# Altium project main_pcb.PrjPcb
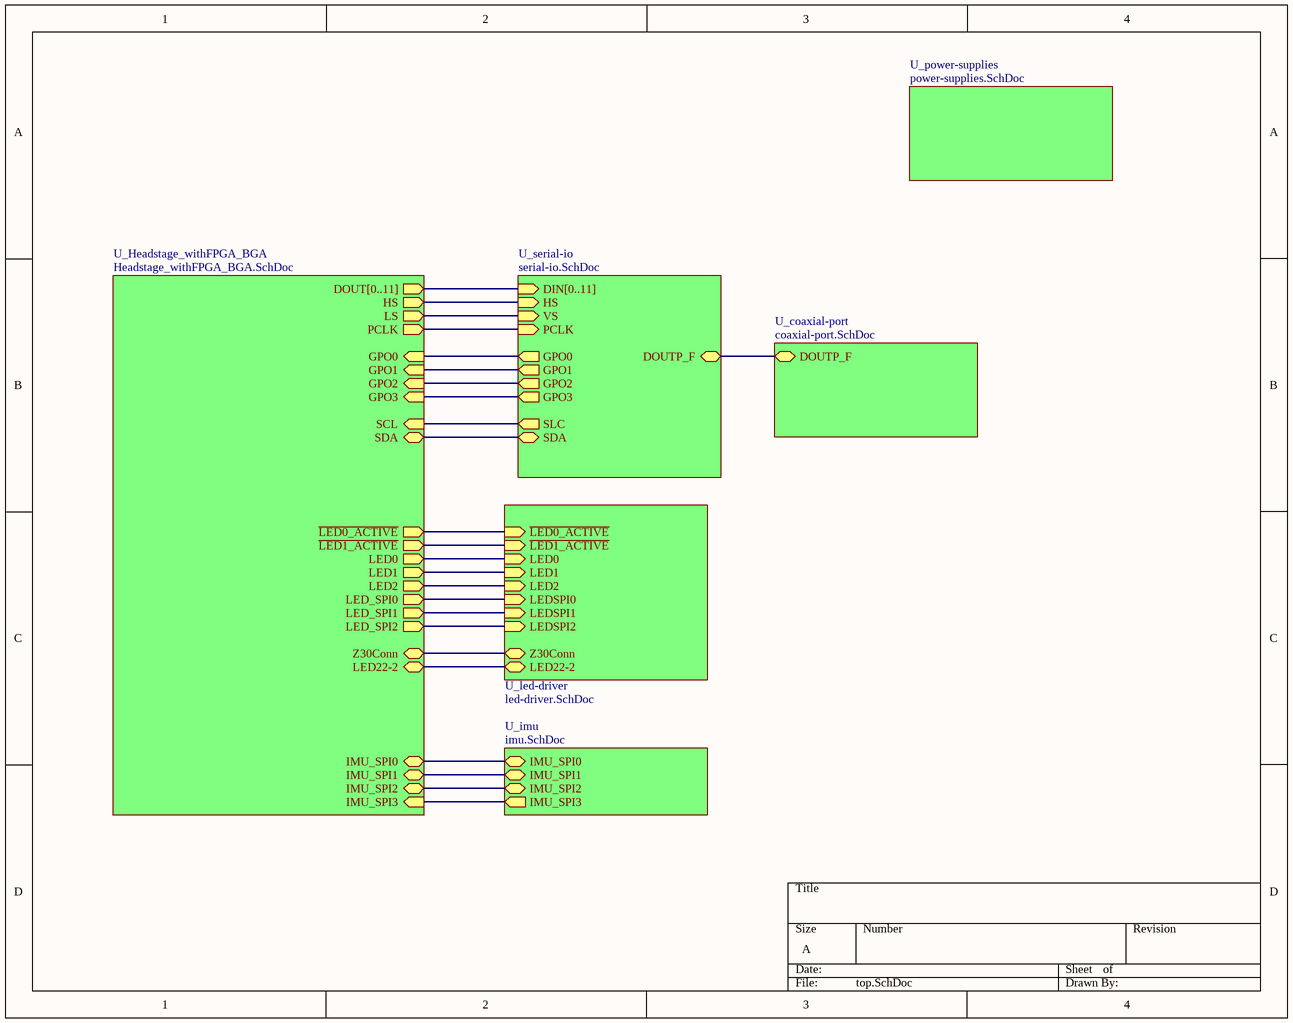
[diagram p0: top.SchDoc]
7 sheets, 127 parts. Net scope: hierarchical (ports join the sheet entries above them; power ports are global).
Board file: top_pcb_4layers_positive.PcbDoc
Sheets:
  top.SchDoc
    U_coaxial-port = coaxial-port.SchDoc
    U_power-supplies = power-supplies.SchDoc
    U_serial-io = serial-io.SchDoc
    U_Headstage_withFPGA_BGA = Headstage_withFPGA_BGA.SchDoc
    U_led-driver = led-driver.SchDoc
    U_imu = imu.SchDoc

## Sheet top.SchDoc
size A

### Sub-sheets
U_coaxial-port = coaxial-port.SchDoc: DOUTP_F (bidir)
U_Headstage_withFPGA_BGA = Headstage_withFPGA_BGA.SchDoc: DOUT[0..11] (out), HS (out), LS (out), PCLK (out), GPO3 (in), GPO2 (in), GPO1 (in), SDA (bidir), SCL (in), GPO0 (in), ~{LED0_ACTIVE} (out), ~{LED1_ACTIVE} (out), LED0 (out), LED1 (out), LED2 (out), LED_SPI0 (out), LED_SPI1 (out), LED_SPI2 (out), Z30Conn (bidir), IMU_SPI0 (bidir), IMU_SPI1 (bidir), IMU_SPI2 (bidir), IMU_SPI3 (in), LED22-2
U_imu = imu.SchDoc: IMU_SPI0 (bidir), IMU_SPI1 (bidir), IMU_SPI2 (bidir), IMU_SPI3 (out)
U_led-driver = led-driver.SchDoc: ~{LED0_ACTIVE} (in), ~{LED1_ACTIVE} (in), LEDSPI0 (in), LED0 (in), LED1 (in), LED2 (in), LEDSPI1 (in), LEDSPI2 (in), Z30Conn (bidir), LED22-2
U_power-supplies = power-supplies.SchDoc: no entries
U_serial-io = serial-io.SchDoc: DIN[0..11] (in), HS (in), VS (in), PCLK (in), DOUTP_F (bidir), SDA (bidir), SLC (out), GPO0 (out), GPO1 (out), GPO2 (out), GPO3 (out)

### Nets
GPO0: sheet U_serial-io/GPO0, sheet U_Headstage_withFPGA_BGA/GPO0
GPO1: sheet U_serial-io/GPO1, sheet U_Headstage_withFPGA_BGA/GPO1
GPO2: sheet U_serial-io/GPO2, sheet U_Headstage_withFPGA_BGA/GPO2
GPO3: sheet U_serial-io/GPO3, sheet U_Headstage_withFPGA_BGA/GPO3
HS: sheet U_serial-io/HS, sheet U_Headstage_withFPGA_BGA/HS
LED0: sheet U_Headstage_withFPGA_BGA/LED0, sheet U_led-driver/LED0
LED1: sheet U_Headstage_withFPGA_BGA/LED1, sheet U_led-driver/LED1
LED2: sheet U_Headstage_withFPGA_BGA/LED2, sheet U_led-driver/LED2
LED22-2: sheet U_Headstage_withFPGA_BGA/LED22-2, sheet U_led-driver/LED22-2
LEDSPI0: sheet U_Headstage_withFPGA_BGA/LED_SPI0, sheet U_led-driver/LEDSPI0
LEDSPI1: sheet U_Headstage_withFPGA_BGA/LED_SPI1, sheet U_led-driver/LEDSPI1
LEDSPI2: sheet U_Headstage_withFPGA_BGA/LED_SPI2, sheet U_led-driver/LEDSPI2
PCLK: sheet U_serial-io/PCLK, sheet U_Headstage_withFPGA_BGA/PCLK
SCL: sheet U_serial-io/SLC, sheet U_Headstage_withFPGA_BGA/SCL
SDA: sheet U_serial-io/SDA, sheet U_Headstage_withFPGA_BGA/SDA
VS: sheet U_serial-io/VS, sheet U_Headstage_withFPGA_BGA/LS
Z30Conn: sheet U_Headstage_withFPGA_BGA/Z30Conn, sheet U_led-driver/Z30Conn
NetC18#1_1: sheet U_coaxial-port/DOUTP_F, sheet U_serial-io/DOUTP_F
NetLD1_21: sheet U_Headstage_withFPGA_BGA/~{LED0_ACTIVE}, sheet U_led-driver/~{LED0_ACTIVE}
NetLD2_21: sheet U_Headstage_withFPGA_BGA/~{LED1_ACTIVE}, sheet U_led-driver/~{LED1_ACTIVE}
(unnamed): sheet U_Headstage_withFPGA_BGA/IMU_SPI0, sheet U_imu/IMU_SPI0
(unnamed): sheet U_Headstage_withFPGA_BGA/IMU_SPI1, sheet U_imu/IMU_SPI1
(unnamed): sheet U_Headstage_withFPGA_BGA/IMU_SPI2, sheet U_imu/IMU_SPI2
(unnamed): sheet U_Headstage_withFPGA_BGA/IMU_SPI3, sheet U_imu/IMU_SPI3

### Buses and harness runs
bus sheet U_Headstage_withFPGA_BGA/DOUT[0..11] = sheet U_serial-io/DIN[0..11]

## Sheet coaxial-port.SchDoc
size A
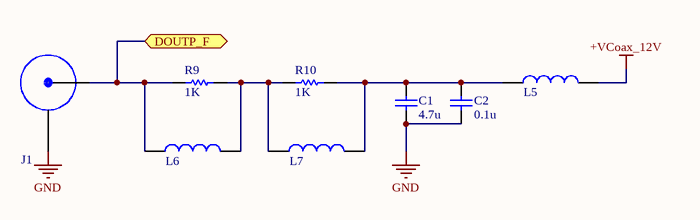
[diagram p1: coaxial-port.SchDoc]

### Parts
C1  value 4.7u  [Cap-0603]  (hidden comment: X7R Ceramic)
C2  value 0.1u  [Cap-0603]  (hidden comment: X7R Ceramic)
J1  Coax Connector  [SMA_132134-10-ND]  (value not drawn)
L5  Ferrite Bead  [BLM18KG601SN1D]  (value not drawn)
L6  Ferrite Bead  [CIG21L4R7MNE]  (value not drawn)
L7  Ferrite Bead  [CBC3225T101MR]  (value not drawn)
R9  value 1K  [Res_0402]  (hidden comment: Res1)
R10  value 1K  [Res_0402]  (hidden comment: Res1)

### Ports
DOUTP_F (bidir)

### Nets
+VCoax_12V: L5.2
GND: C1.1 C2.1 J1.1
NetC1_2: C1.2 C2.2 L5.1 L7.2 R10.1
NetC18#1_1: J1.0 L6.1 R9.2 ; port DOUTP_F
NetL6_2: L6.2 L7.1 R9.1 R10.2

### Library data of the parts
C1 C2 = Cap: Capacitor; Published: 8-Jun-2000; LatestRevisionDate: 17-Jul-2002; LatestRevisionNote: Re-released for DXP Platform.; PackageReference: RAD-0.3; Publisher: Altium Limited; PackageDescription: Radial Cap, Thru-Hole; 2 Leads; 0.3 in Pin Spacing
R9 R10 = Res1: Resistor; Published: 8-Jun-2000; LatestRevisionDate: 17-Jul-2002; LatestRevisionNote: Re-released for DXP Platform.; PackageReference: AXIAL-0.3; Publisher: Altium Limited; PackageDescription: Axial Device, Thru-Hole; 2 Leads; 0.3 in Pin Spacing

## Sheet power-supplies.SchDoc
size A
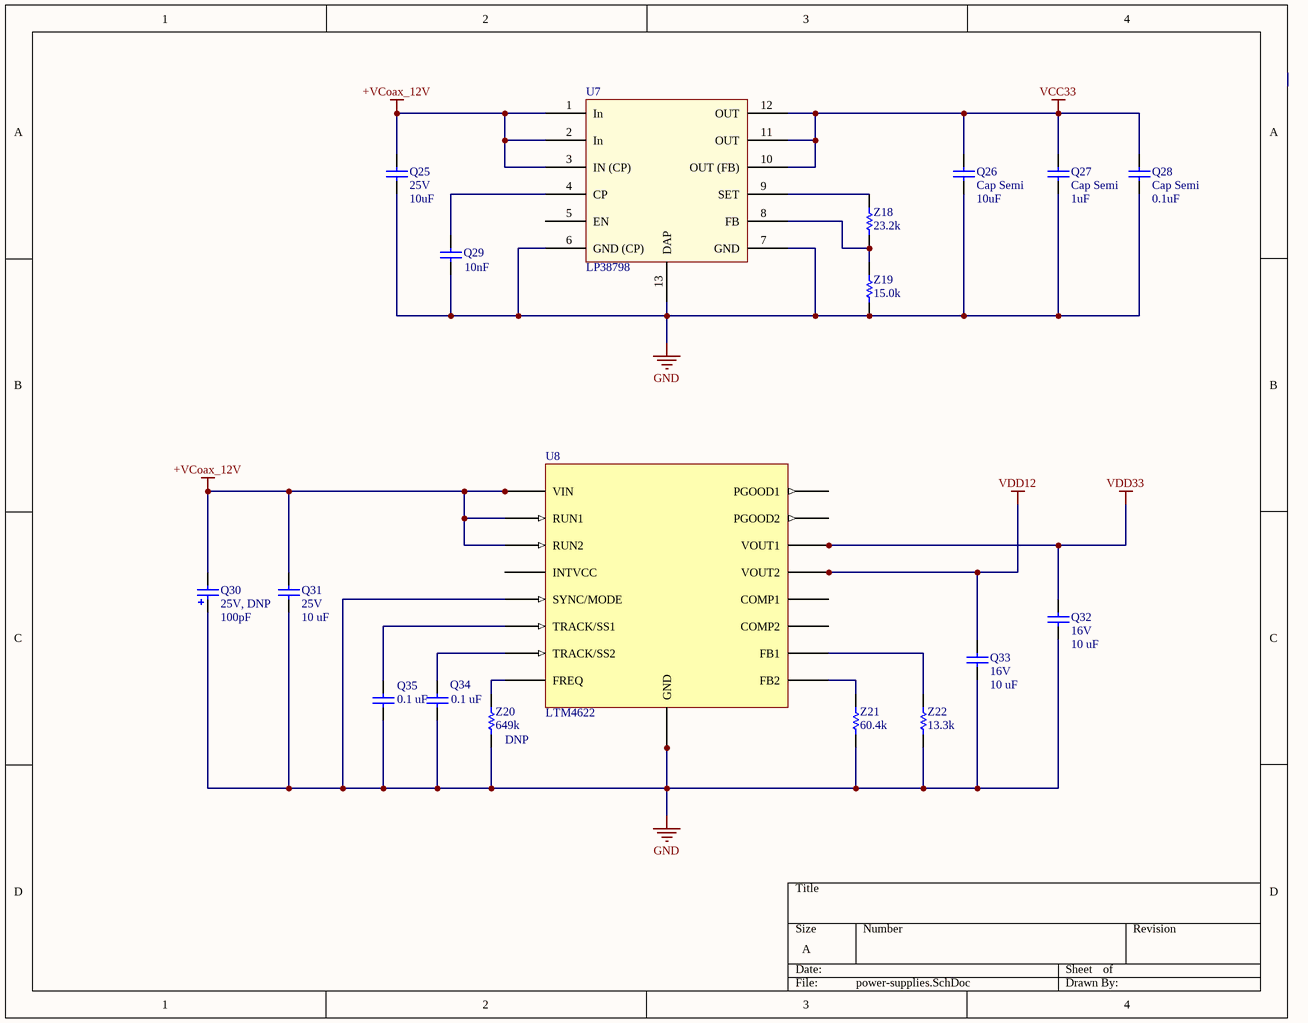
[diagram p2: power-supplies.SchDoc]

### Parts
Q25  25V  value 10uF  [C1206]
Q26  Cap Semi  value 10uF  [Cap-0603]
Q27  Cap Semi  value 1uF  [Cap-0603]
Q28  Cap Semi  value 0.1uF  [Cap-0603]
Q29  value 10nF  [0402]
Q30  25V, DNP  value 100pF  [C0805]
Q31  25V  value 10 uF  [C1206]
Q32  16V  value 10 uF  [C1206]
Q33  16V  value 10 uF  [C1206]
Q34  value 0.1 uF  [C1206]  (hidden comment: 25V)
Q35  value 0.1 uF  [C1206]  (hidden comment: 25V)
U7  LP38798  [DFN12]
U8  LTM4622  [LGA5x5]
Z18  value 23.2k  [Res_0402]  (hidden comment: Res1)
Z19  value 15.0k  [Res_0402]  (hidden comment: Res1)
Z20  DNP  value 649k  [Res_0402]
Z21  value 60.4k  [Res_0402]  (hidden comment: 649k (DNP))
Z22  value 13.3k  [Res_0402]

### Nets
+VCoax_12V: Q25.2 Q30.2 Q31.2 U7.1(In) U7.2(In) U7.3(IN_(CP)) U8.A2(VIN) U8.B2(RUN2) U8.B3(VIN) U8.D2(RUN1) U8.D3(VIN) U8.E2(VIN)
GND: Q25.1 Q26.1 Q27.1 Q28.1 Q29.1 Q30.1 Q31.1 Q32.1 Q33.1 Q34.1 Q35.1 U7.6(GND_(CP)) U7.7(GND) U7.13(DAP) U8.B5(GND) U8.C1(GND) U8.C2(GND) U8.C5(SYNC/MODE) U8.D5(GND) Z19.2 Z20.2 Z21.2 Z22.2
VCC33: Q26.2 Q27.2 Q28.2 U7.10(OUT_(FB)) U7.11(OUT) U7.12(OUT)
VDD12: Q33.2 U8.A1(VOUT2) U8.B1(VOUT2)
VDD33: Q32.2 U8.D1(VOUT1) U8.E1(VOUT1)
NetQ29_2: Q29.2 U7.4(CP)
NetQ34_2: Q34.2 U8.A3(TRACK/SS2)
NetQ35_2: Q35.2 U8.E5(TRACK/SS1)
NetU7_8: U7.8(FB) Z18.2 Z19.1
NetU7_9: U7.9(SET) Z18.1
NetU8_A4: U8.A4(FB2) Z21.1
NetU8_C4: U8.C4(FREQ) Z20.1
NetU8_E4: U8.E4(FB1) Z22.1

Not connected (* = marked no-connect by the designer): U7 5(EN); U8 A5(COMP2) B4(PGOOD2) C3(INTVCC) D4(PGOOD1)

### Library data of the parts
Q25-Q29 Q31-Q35 = Cap Semi: Capacitor (Semiconductor SIM Model); Published: 8-Jun-2000; LatestRevisionDate: 29-May-2009; LatestRevisionNote: IPC-7351 Footprint Added.; PackageReference: C1206; Publisher: Altium Limited; PackageDescription: Chip Capacitor
  Q31 Q34 Q35: Voltage: 25 V
  Q32 Q33: Voltage: 16 V
Q30 = Cap Pol3: Polarized Capacitor (Surface Mount); Published: 8-Jun-2000; LatestRevisionDate: 29-May-2009; LatestRevisionNote: IPC-7351 Footprint Added.; PackageReference: C0805; Publisher: Altium Limited; PackageDescription: Chip Capacitor
U7 = Component_1: Low Noise Positive LDO
Z18-Z22 = Res1: Resistor; Published: 8-Jun-2000; LatestRevisionDate: 17-Jul-2002; LatestRevisionNote: Re-released for DXP Platform.; PackageReference: AXIAL-0.3; Publisher: Altium Limited; PackageDescription: Axial Device, Thru-Hole; 2 Leads; 0.3 in Pin Spacing

## Sheet serial-io.SchDoc
size A
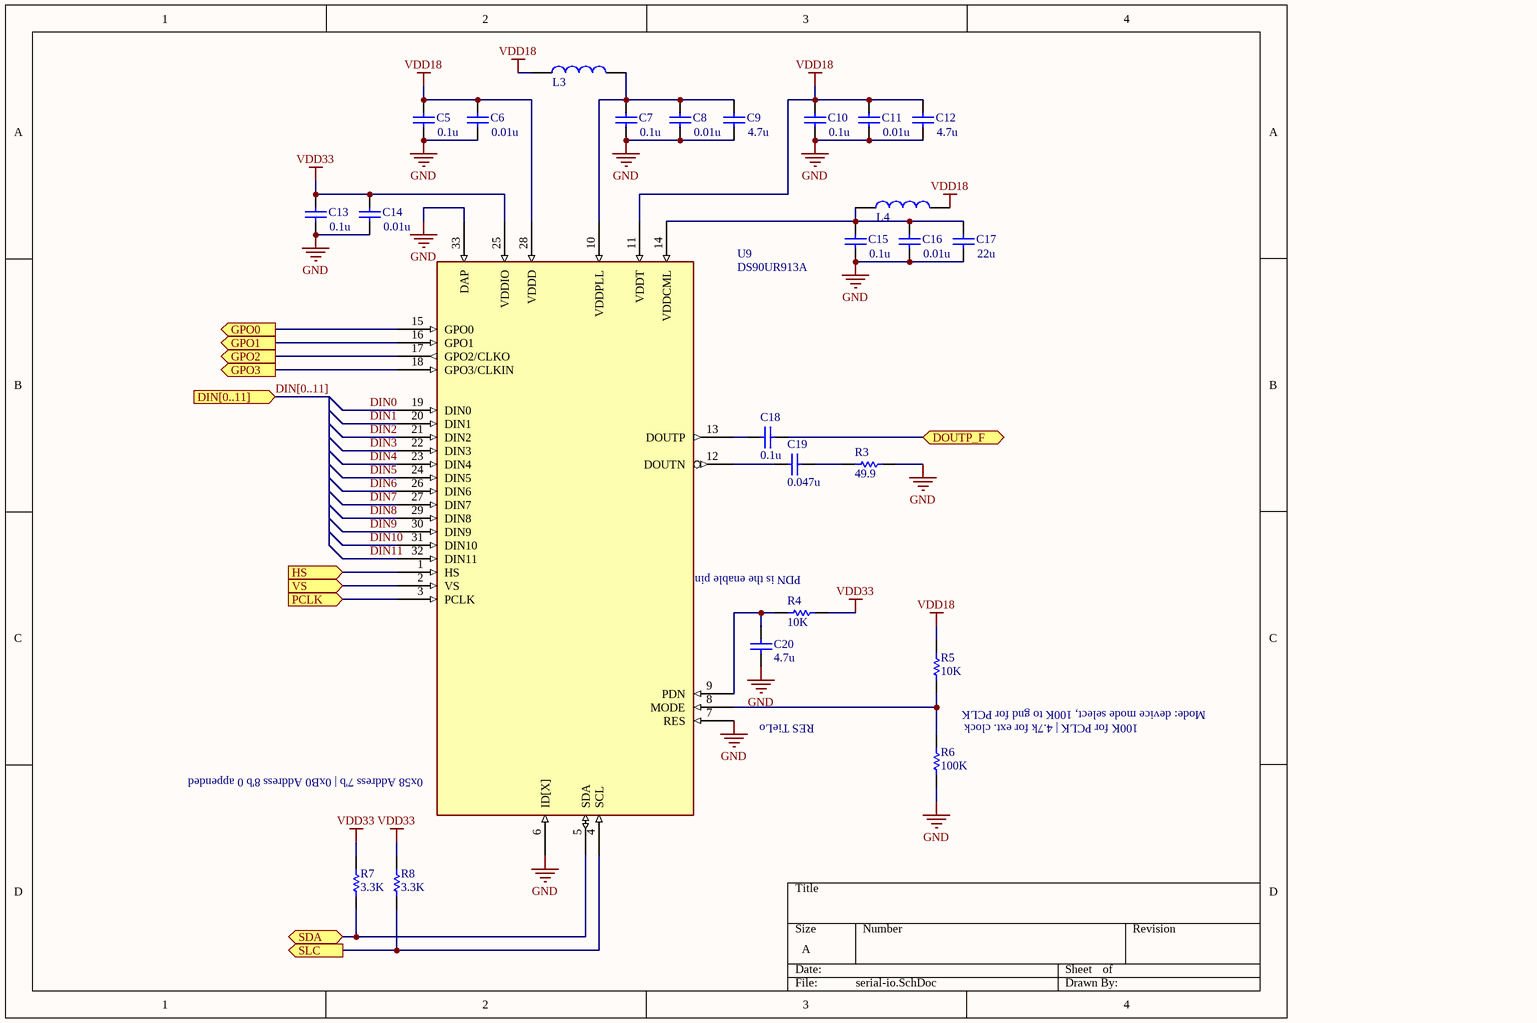
[diagram p3: serial-io.SchDoc]

### Parts
(Parts that share a designator on the sheet are numbered #1, #2 ... from top to bottom, then left to right.)
C5  value 0.1u  [Cap_0402]  (hidden comment: X7R Ceramic)
C6  value 0.01u  [Cap_0402]  (hidden comment: X7R Ceramic)
C7  value 0.1u  [Cap_0402]  (hidden comment: X7R Ceramic)
C8  value 0.01u  [Cap_0402]  (hidden comment: X7R Ceramic)
C9  value 4.7u  [Cap_0402]  (hidden comment: X7R Ceramic)
C10  value 0.1u  [Cap_0402]  (hidden comment: X7R Ceramic)
C11  value 0.01u  [Cap_0402]  (hidden comment: X7R Ceramic)
C12  value 4.7u  [Cap_0402]  (hidden comment: X7R Ceramic)
C13  value 0.1u  [Cap_0402]  (hidden comment: X7R Ceramic)
C14  value 0.01u  [Cap_0402]  (hidden comment: X7R Ceramic)
C15  value 0.1u  [Cap_0402]  (hidden comment: X7R Ceramic)
C16  value 0.01u  [Cap_0402]  (hidden comment: X7R Ceramic)
C17  value 22u  [Cap-0603]  (hidden comment: X7R Ceramic)
C18#1  value 0.1u  [Cap_0402]  (hidden comment: X7R Ceramic)
C19  value 0.047u  [Cap_0402]  (hidden comment: X7R Ceramic)
C20  value 4.7u  [Cap_0402]  (hidden comment: X7R Ceramic)
L3  Ferrite Bead  [BLM18KG601SN1D]  (value not drawn)
L4  Ferrite Bead  [BLM18KG601SN1D]  (value not drawn)
R3  value 49.9  [Res_0402]  (hidden comment: Res1)
R4  value 10K  [Res_0402]  (hidden comment: Res1)
R5  value 10K  [Res_0402]  (hidden comment: Res1)
R6  value 100K  [Res_0402]  (hidden comment: Res1)
R7  value 3.3K  [Res_0402]  (hidden comment: Res1)
R8  value 3.3K  [Res_0402]  (hidden comment: Res1)
U9  DS90UR913A  [WQFN32-DS90UB913A]

### Ports
DIN[0..11] (in), DOUTP_F (bidir), GPO0 (out), GPO1 (out), GPO2 (out), GPO3 (out), HS (in), PCLK (in), SDA (bidir), SLC (out), VS (in)

### Nets
GND: C5.1 C6.1 C7.1 C8.1 C9.1 C10.1 C11.1 C12.1 C13.1 C14.1 C15.1 C16.1 C17.1 C20.1 R3.2 R6.1 U9.6(ID[X]) U9.7(RES) U9.33(DAP)
VDD18: C5.2 C6.2 C10.2 C11.2 C12.2 L3.1 L4.2 R5.2 U9.11(VDDT) U9.28(VDDD)
VDD33: C13.2 C14.2 R4.2 R7.2 R8.2 U9.25(VDDIO)
DIN0: U9.19(DIN0)
DIN1: U9.20(DIN1)
DIN2: U9.21(DIN2)
DIN3: U9.22(DIN3)
DIN4: U9.23(DIN4)
DIN5: U9.24(DIN5)
DIN6: U9.26(DIN6)
DIN7: U9.27(DIN7)
DIN8: U9.29(DIN8)
DIN9: U9.30(DIN9)
DIN10: U9.31(DIN10)
DIN11: U9.32(DIN11)
GPO0: U9.15(GPO0) ; port GPO0
GPO1: U9.16(GPO1) ; port GPO1
GPO2: U9.17(GPO2/CLKO) ; port GPO2
GPO3: U9.18(GPO3/CLKIN) ; port GPO3
HS: U9.1(HS) ; port HS
PCLK: U9.3(PCLK) ; port PCLK
SCL: R8.1 U9.4(SCL) ; port SLC
SDA: R7.1 U9.5(SDA) ; port SDA
VS: U9.2(VS) ; port VS
NetC7_2: C7.2 C8.2 C9.2 L3.2 U9.10(VDDPLL)
NetC15_2: C15.2 C16.2 C17.2 L4.1 U9.14(VDDCML)
NetC18#1_1: C18#1.1 ; port DOUTP_F
NetC18#1_2: C18#1.2 U9.13(DOUTP)
NetC19_1: C19.1 R3.1
NetC19_2: C19.2 U9.12(DOUTN)
NetC20_2: C20.2 R4.1 U9.9(PDN)
NetR5_1: R5.1 R6.2 U9.8(MODE)

### Buses and harness runs
bus DIN[0..11] = port DIN[0..11]

### Notes on the sheet
- (near U9) PDN is the enable pin
- Mode: device mode select, 100K to gnd for PCLK
- (near U9) 0x58 Address 7'b | 0xB0 Address 8'b 0 appended
- RES TieLo
- (near R6) 100K for PCLK | 4.7k for ext. clock

### Library data of the parts
C5-C17 C18#1 C19 C20 = Cap: Capacitor; Published: 8-Jun-2000; LatestRevisionDate: 17-Jul-2002; LatestRevisionNote: Re-released for DXP Platform.; PackageReference: RAD-0.3; Publisher: Altium Limited; PackageDescription: Radial Cap, Thru-Hole; 2 Leads; 0.3 in Pin Spacing
R3-R8 = Res1: Resistor; Published: 8-Jun-2000; LatestRevisionDate: 17-Jul-2002; LatestRevisionNote: Re-released for DXP Platform.; PackageReference: AXIAL-0.3; Publisher: Altium Limited; PackageDescription: Axial Device, Thru-Hole; 2 Leads; 0.3 in Pin Spacing
U9 = DS90UR913A: DS90UR913ASERIALIZER

## Sheet Headstage_withFPGA_BGA.SchDoc
size D
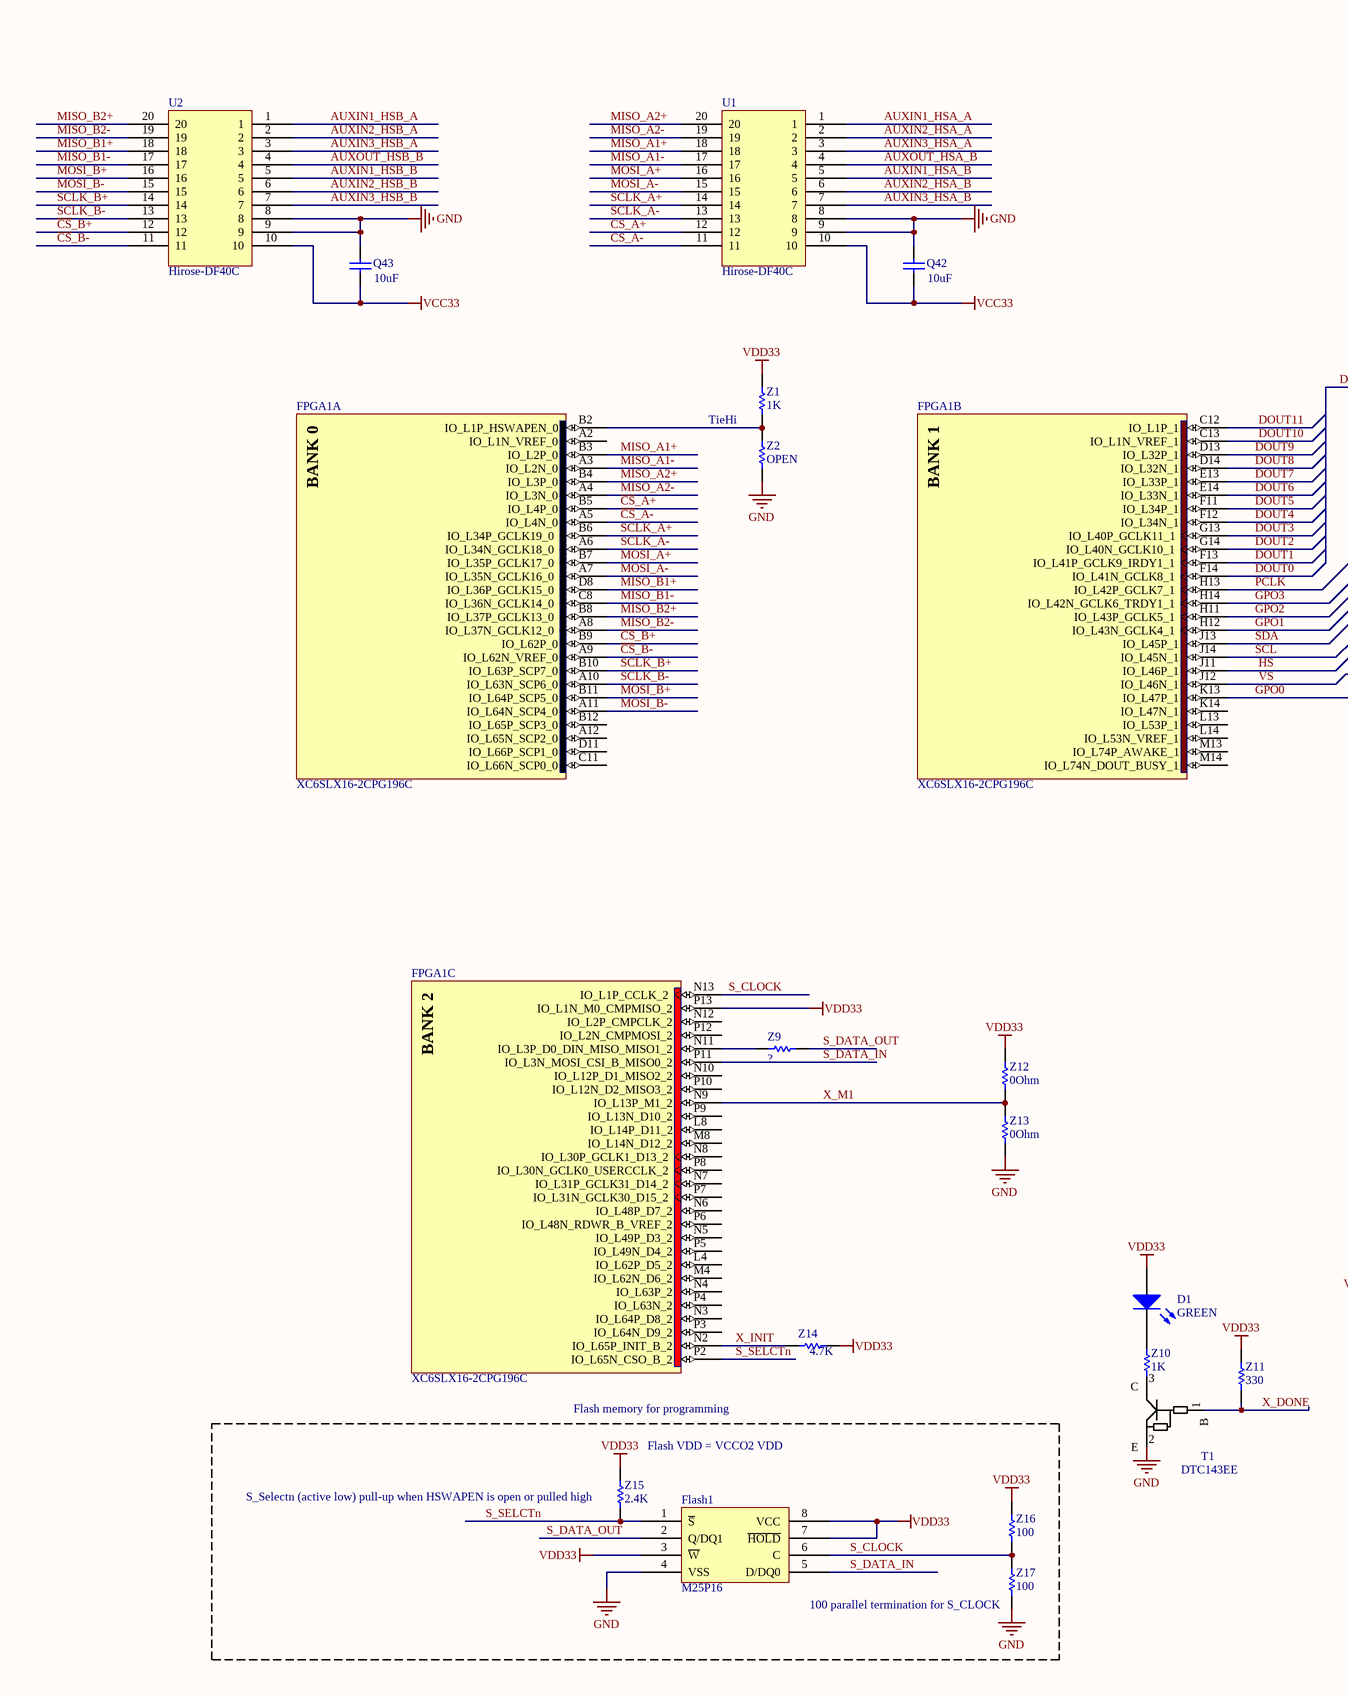
[diagram p4: Headstage_withFPGA_BGA.SchDoc, left]
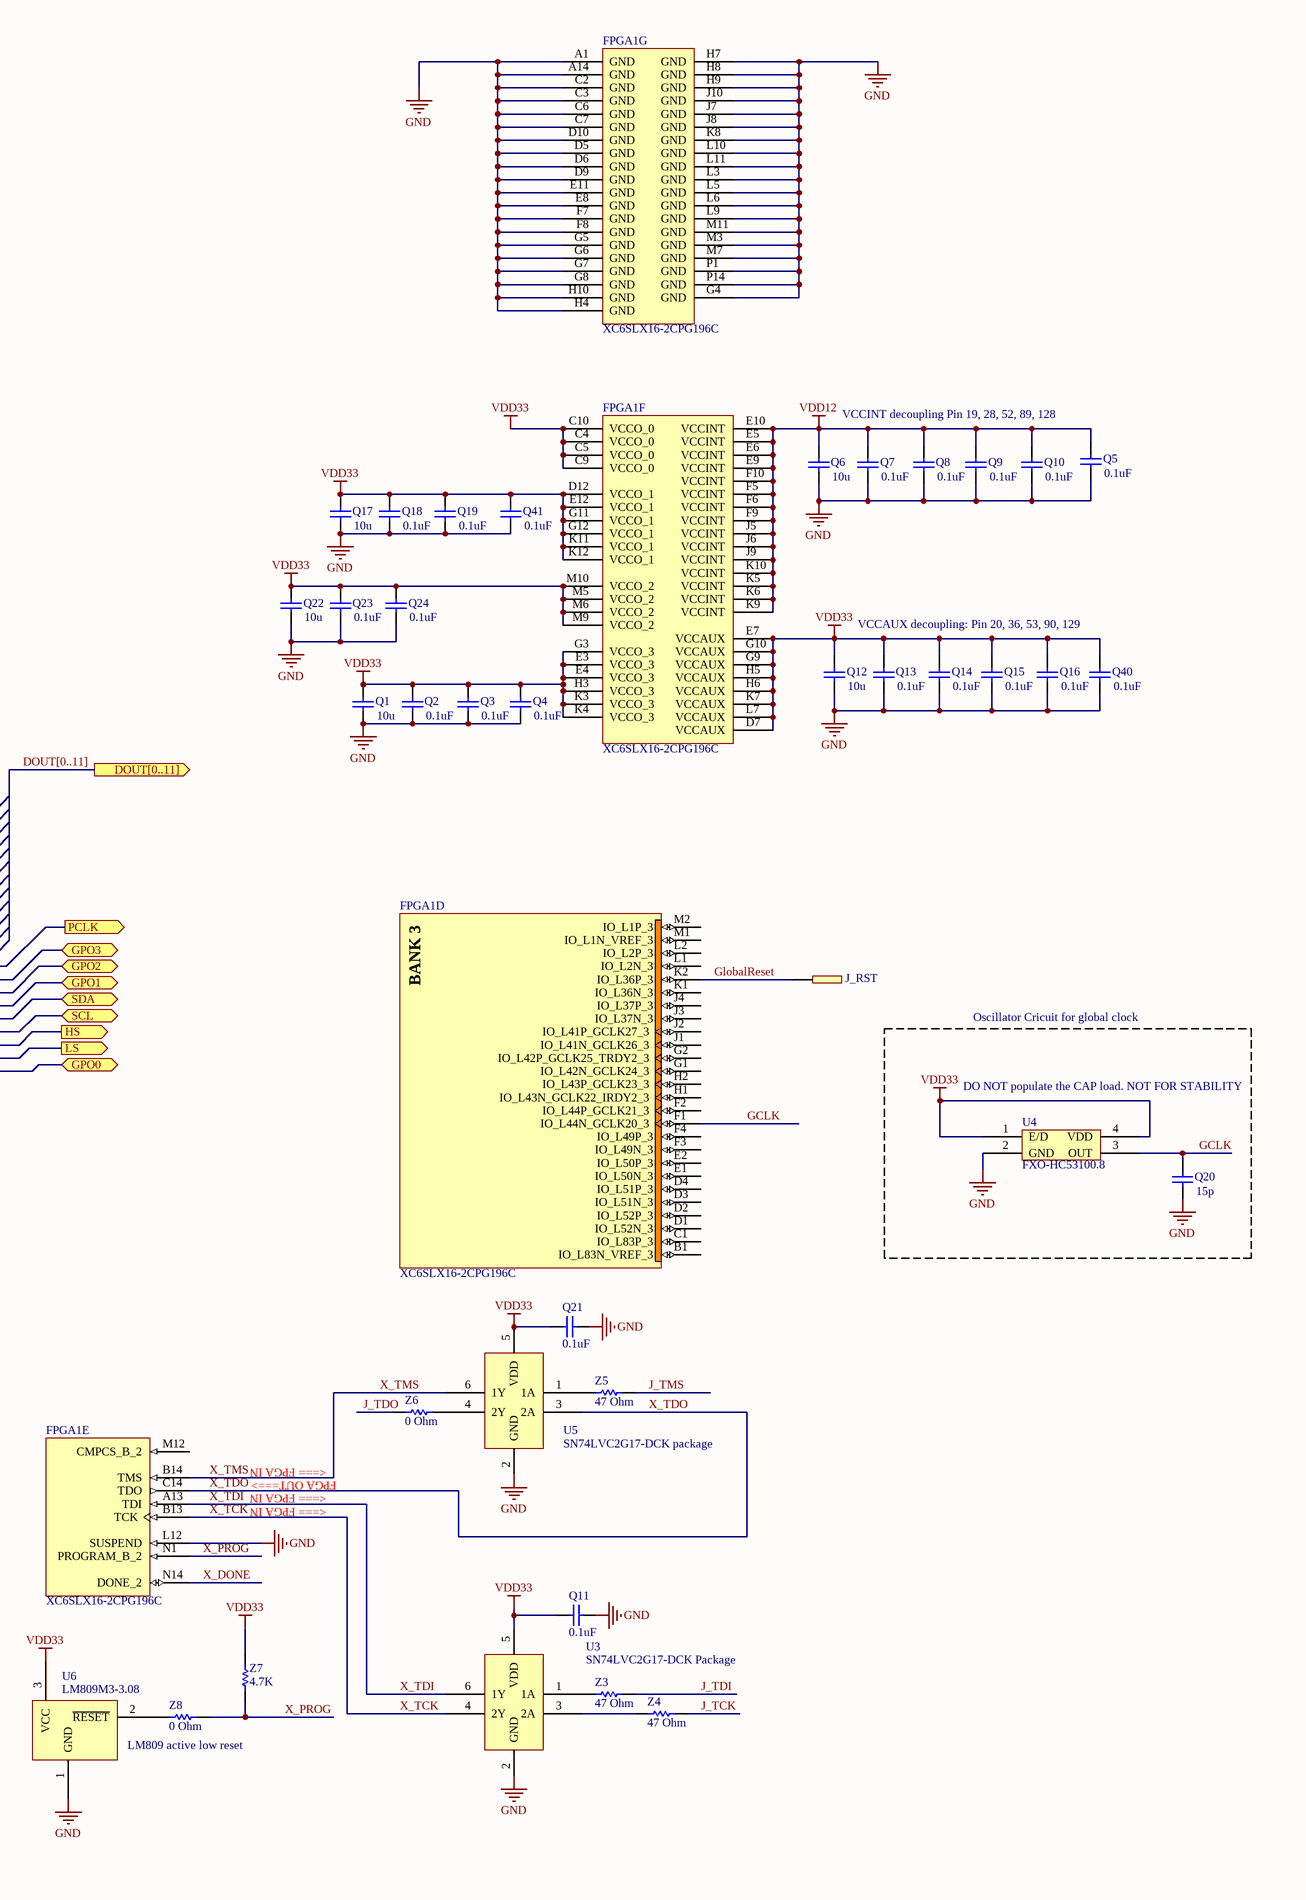
[diagram p5: Headstage_withFPGA_BGA.SchDoc, right]

### Parts
(Parts that share a designator on the sheet are numbered #1, #2 ... from top to bottom, then left to right.)
D1  GREEN  [RES_0603]
Flash1  M25P16  [M25P16-S08N]
FPGA1  XC6SLX16-2CPG196C  [CPG196]  (parts A,B,C,D,E,F,G of 7)
J_RST  Header_1PIN  [JUMPER1PIN]  (value not drawn)
Q1  value 10u  [Cap-0603]  (hidden comment: X7R Ceramic)
Q2  value 0.1uF  [Cap_0402]  (hidden comment: X7R Ceramic)
Q3  value 0.1uF  [Cap_0402]  (hidden comment: X7R Ceramic)
Q4  value 0.1uF  [Cap_0402]  (hidden comment: X7R Ceramic)
Q5  value 0.1uF  [Cap_0402]  (hidden comment: X7R Ceramic)
Q6  value 10u  [Cap-0603]  (hidden comment: X7R Ceramic)
Q7  value 0.1uF  [Cap_0402]  (hidden comment: X7R Ceramic)
Q8  value 0.1uF  [Cap_0402]  (hidden comment: X7R Ceramic)
Q9  value 0.1uF  [Cap_0402]  (hidden comment: X7R Ceramic)
Q10  value 0.1uF  [Cap_0402]  (hidden comment: X7R Ceramic)
Q11  value 0.1uF  [Cap-0603]  (hidden comment: X7R Ceramic)
Q12  value 10u  [Cap-0603]  (hidden comment: X7R Ceramic)
Q13  value 0.1uF  [Cap_0402]  (hidden comment: X7R Ceramic)
Q14  value 0.1uF  [Cap_0402]  (hidden comment: X7R Ceramic)
Q15  value 0.1uF  [Cap_0402]  (hidden comment: X7R Ceramic)
Q16  value 0.1uF  [Cap_0402]  (hidden comment: X7R Ceramic)
Q17  value 10u  [Cap-0603]  (hidden comment: X7R Ceramic)
Q18  value 0.1uF  [Cap_0402]  (hidden comment: X7R Ceramic)
Q19  value 0.1uF  [Cap_0402]  (hidden comment: X7R Ceramic)
Q20  value 15p  [Cap-0603]  (hidden comment: X7R Ceramic)
Q21  value 0.1uF  [Cap-0603]  (hidden comment: X7R Ceramic)
Q22  value 10u  [Cap-0603]  (hidden comment: X7R Ceramic)
Q23  value 0.1uF  [Cap_0402]  (hidden comment: X7R Ceramic)
Q24  value 0.1uF  [Cap_0402]  (hidden comment: X7R Ceramic)
Q40  value 0.1uF  [Cap_0402]  (hidden comment: X7R Ceramic)
Q41  value 0.1uF  [Cap_0402]  (hidden comment: X7R Ceramic)
Q42  value 10uF  [Cap_0402]  (hidden comment: X7R Ceramic)
Q43  value 10uF  [Cap_0402]  (hidden comment: X7R Ceramic)
T1  DTC143EE  [VMT3]
U1#1  Hirose-DF40C  [DF40]
U2  Hirose-DF40C  [DF40]
U3  SN74LVC2G17-DCK Package  [SN74LVC2G17-DCK-package]
U4  FXO-HC53100.8  [FXO-HC53]
U5  SN74LVC2G17-DCK package  [SN74LVC2G17-DCK-package]
U6  LM809M3-3.08  [SOT23]
Z1  value 1K  [Res_0402]  (hidden comment: Res1)
Z2  value OPEN  [Res_0402]  (hidden comment: Res1)
Z3  value 47 Ohm  [Res_0402]  (hidden comment: Res1)
Z4  value 47 Ohm  [Res_0402]  (hidden comment: Res1)
Z5  value 47 Ohm  [Res_0402]  (hidden comment: Res1)
Z6  value 0 Ohm  [Res_0402]  (hidden comment: Res1)
Z7  value 4.7K  [Res_0402]  (hidden comment: Res1)
Z8  value 0 Ohm  [Res_0402]  (hidden comment: Res1)
Z9  Res1  [Res_0402]  (value not drawn)
Z10  value 1K  [Res_0402]  (hidden comment: Res1)
Z11  value 330  [Res_0402]  (hidden comment: Res1)
Z12  value 0Ohm  [Res_0402]  (hidden comment: Res1)
Z13  value 0Ohm  [Res_0402]  (hidden comment: Res1)
Z14  value 4.7K  [Res_0402]  (hidden comment: Res1)
Z15  value 2.4K  [Res_0402]  (hidden comment: Res1)
Z16  value 100  [Res_0402]  (hidden comment: Res1)
Z17  value 100  [Res_0402]  (hidden comment: Res1)

### Ports
DOUT[0..11] (out), GPO0 (bidir), GPO1 (bidir), GPO2 (bidir), GPO3 (bidir), HS (out), LS (out), PCLK (out), SCL (bidir), SDA (bidir)

### Nets
GND: Flash1.4(VSS) FPGA1.A1(GND) FPGA1.A14(GND) FPGA1.C2(GND) FPGA1.C3(GND) FPGA1.C6(GND) FPGA1.C7(GND) FPGA1.D5(GND) FPGA1.D6(GND) FPGA1.D9(GND) FPGA1.D10(GND) FPGA1.E8(GND) FPGA1.E11(GND) FPGA1.F7(GND) FPGA1.F8(GND) FPGA1.G4(GND) FPGA1.G5(GND) FPGA1.G6(GND) FPGA1.G7(GND) FPGA1.G8(GND) FPGA1.H4(GND) FPGA1.H7(GND) FPGA1.H8(GND) FPGA1.H9(GND) FPGA1.H10(GND) FPGA1.J7(GND) FPGA1.J8(GND) FPGA1.J10(GND) FPGA1.K8(GND) FPGA1.L3(GND) FPGA1.L5(GND) FPGA1.L6(GND) FPGA1.L9(GND) FPGA1.L10(GND) FPGA1.L11(GND) FPGA1.L12(SUSPEND) FPGA1.M3(GND) FPGA1.M7(GND) FPGA1.M11(GND) FPGA1.P1(GND) FPGA1.P14(GND) Q1.1 Q2.1 Q3.1 Q4.1 Q5.1 Q6.1 Q7.1 Q8.1 Q9.1 Q10.1 Q11.1 Q12.1 Q13.1 Q14.1 Q15.1 Q16.1 Q17.1 Q18.1 Q19.1 Q20.1 Q21.1 Q22.1 Q23.1 Q24.1 Q40.1 Q41.1 Q42.2 Q43.2 T1.2(E) U1#1.8 U1#1.9 U2.8 U2.9 U3.2(GND) U4.2(GND) U5.2(GND) U6.1(GND) Z2.1 Z13.1 Z17.1
VCC33: Q42.1 Q43.1 U1#1.10 U2.10
VDD12: FPGA1.E5(VCCINT) FPGA1.E6(VCCINT) FPGA1.E9(VCCINT) FPGA1.E10(VCCINT) FPGA1.F5(VCCINT) FPGA1.F6(VCCINT) FPGA1.F9(VCCINT) FPGA1.F10(VCCINT) FPGA1.J5(VCCINT) FPGA1.J6(VCCINT) FPGA1.J9(VCCINT) FPGA1.K5(VCCINT) FPGA1.K6(VCCINT) FPGA1.K9(VCCINT) FPGA1.K10(VCCINT) Q5.2 Q6.2 Q7.2 Q8.2 Q9.2 Q10.2
VDD33: D1.1(A) Flash1.3(~{W}) Flash1.7(~{HOLD}) Flash1.8(VCC) FPGA1.C4(VCCO_0) FPGA1.C5(VCCO_0) FPGA1.C9(VCCO_0) FPGA1.C10(VCCO_0) FPGA1.D7(VCCAUX) FPGA1.D12(VCCO_1) FPGA1.E3(VCCO_3) FPGA1.E4(VCCO_3) FPGA1.E7(VCCAUX) FPGA1.E12(VCCO_1) FPGA1.G3(VCCO_3) FPGA1.G9(VCCAUX) FPGA1.G10(VCCAUX) FPGA1.G11(VCCO_1) FPGA1.G12(VCCO_1) FPGA1.H3(VCCO_3) FPGA1.H5(VCCAUX) FPGA1.H6(VCCAUX) FPGA1.K3(VCCO_3) FPGA1.K4(VCCO_3) FPGA1.K7(VCCAUX) FPGA1.K11(VCCO_1) FPGA1.K12(VCCO_1) FPGA1.L7(VCCAUX) FPGA1.M5(VCCO_2) FPGA1.M6(VCCO_2) FPGA1.M9(VCCO_2) FPGA1.M10(VCCO_2) FPGA1.P13(IO_L1N_M0_CMPMISO_2) Q1.2 Q2.2 Q3.2 Q4.2 Q11.2 Q12.2 Q13.2 Q14.2 Q15.2 Q16.2 Q17.2 Q18.2 Q19.2 Q21.2 Q22.2 Q23.2 Q24.2 Q40.2 Q41.2 U3.5(VDD) U4.1(E/D) U4.4(VDD) U5.5(VDD) U6.3(VCC) Z1.2 Z7.1 Z11.2 Z12.2 Z14.1 Z15.2 Z16.2
AUXIN1_HSA_A: U1#1.1
AUXIN1_HSA_B: U1#1.5
AUXIN1_HSB_A: U2.1
AUXIN1_HSB_B: U2.5
AUXIN2_HSA_A: U1#1.2
AUXIN2_HSA_B: U1#1.6
AUXIN2_HSB_A: U2.2
AUXIN2_HSB_B: U2.6
AUXIN3_HSA_A: U1#1.3
AUXIN3_HSA_B: U1#1.7
AUXIN3_HSB_A: U2.3
AUXIN3_HSB_B: U2.7
AUXOUT_HSA_B: U1#1.4
AUXOUT_HSB_B: U2.4
~{CS}_A+: FPGA1.B5(IO_L4P_0) U1#1.12
~{CS}_A-: FPGA1.A5(IO_L4N_0) U1#1.11
~{CS}_B+: FPGA1.B9(IO_L62P_0) U2.12
~{CS}_B-: FPGA1.A9(IO_L62N_VREF_0) U2.11
DOUT0: FPGA1.F14(IO_L41N_GCLK8_1)  [project net DIN0]
DOUT1: FPGA1.F13(IO_L41P_GCLK9_IRDY1_1)  [project net DIN1]
DOUT2: FPGA1.G14(IO_L40N_GCLK10_1)  [project net DIN2]
DOUT3: FPGA1.G13(IO_L40P_GCLK11_1)  [project net DIN3]
DOUT4: FPGA1.F12(IO_L34N_1)  [project net DIN4]
DOUT5: FPGA1.F11(IO_L34P_1)  [project net DIN5]
DOUT6: FPGA1.E14(IO_L33N_1)  [project net DIN6]
DOUT7: FPGA1.E13(IO_L33P_1)  [project net DIN7]
DOUT8: FPGA1.D14(IO_L32N_1)  [project net DIN8]
DOUT9: FPGA1.D13(IO_L32P_1)  [project net DIN9]
DOUT10: FPGA1.C13(IO_L1N_VREF_1)  [project net DIN10]
DOUT11: FPGA1.C12(IO_L1P_1)  [project net DIN11]
GCLK: FPGA1.F1(IO_L44N_GCLK20_3) Q20.2 U4.3(OUT)
GlobalReset: FPGA1.K2(IO_L36P_3) J_RST.0
GPO0: FPGA1.K13(IO_L47P_1) ; port GPO0
GPO1: FPGA1.H12(IO_L43N_GCLK4_1) ; port GPO1
GPO2: FPGA1.H11(IO_L43P_GCLK5_1) ; port GPO2
GPO3: FPGA1.H14(IO_L42N_GCLK6_TRDY1_1) ; port GPO3
HS: FPGA1.J11(IO_L46P_1) ; port HS
J_TCK: Z4.1
J_TDI: Z3.1
J_TDO: Z6.2
J_TMS: Z5.1
MISO_A1+: FPGA1.B3(IO_L2P_0) U1#1.18
MISO_A1-: FPGA1.A3(IO_L2N_0) U1#1.17
MISO_A2+: FPGA1.B4(IO_L3P_0) U1#1.20
MISO_A2-: FPGA1.A4(IO_L3N_0) U1#1.19
MISO_B1+: FPGA1.D8(IO_L36P_GCLK15_0) U2.18
MISO_B1-: FPGA1.C8(IO_L36N_GCLK14_0) U2.17
MISO_B2+: FPGA1.B8(IO_L37P_GCLK13_0) U2.20
MISO_B2-: FPGA1.A8(IO_L37N_GCLK12_0) U2.19
MOSI_A+: FPGA1.B7(IO_L35P_GCLK17_0) U1#1.16
MOSI_A-: FPGA1.A7(IO_L35N_GCLK16_0) U1#1.15
MOSI_B+: FPGA1.B11(IO_L64P_SCP5_0) U2.16
MOSI_B-: FPGA1.A11(IO_L64N_SCP4_0) U2.15
PCLK: FPGA1.H13(IO_L42P_GCLK7_1) ; port PCLK
S_CLOCK: Flash1.6(C) FPGA1.N13(IO_L1P_CCLK_2) Z16.1 Z17.2
S_DATA_IN: Flash1.5(D/DQ0) FPGA1.P11(IO_L3N_MOSI_CSI_B_MISO0_2)
S_DATA_OUT: Flash1.2(Q/DQ1) Z9.1
S_SELCTn: Flash1.1(~{S}) FPGA1.P2(IO_L65N_CSO_B_2) Z15.1
SCL: FPGA1.J14(IO_L45N_1) ; port SCL
SCLK_A+: FPGA1.B6(IO_L34P_GCLK19_0) U1#1.14
SCLK_A-: FPGA1.A6(IO_L34N_GCLK18_0) U1#1.13
SCLK_B+: FPGA1.B10(IO_L63P_SCP7_0) U2.14
SCLK_B-: FPGA1.A10(IO_L63N_SCP6_0) U2.13
SDA: FPGA1.J13(IO_L45P_1) ; port SDA
VS: FPGA1.J12(IO_L46N_1) ; port LS
X_DONE: FPGA1.N14(DONE_2) T1.1(B) Z11.1
X_INIT: FPGA1.N2(IO_L65P_INIT_B_2) Z14.2
X_M1: FPGA1.N9(IO_L13P_M1_2) Z12.1 Z13.2
X_PROG: FPGA1.N1(PROGRAM_B_2) Z7.2 Z8.1
X_TCK: FPGA1.B13(TCK) U3.4(2Y)
X_TDI: FPGA1.A13(TDI) U3.6(1Y)
X_TDO: FPGA1.C14(TDO) U5.3(2A)
X_TMS: FPGA1.B14(TMS) U5.6(1Y)
NetD1_2: D1.2(K) Z10.2
NetFPGA1_B2: FPGA1.B2(IO_L1P_HSWAPEN_0) Z1.1 Z2.2
NetFPGA1_N11: FPGA1.N11(IO_L3P_D0_DIN_MISO_MISO1_2) Z9.2
NetU3_1: U3.1(1A) Z3.2
NetU3_3: U3.3(2A) Z4.2
NetU5_1: U5.1(1A) Z5.2
NetU5_4: U5.4(2Y) Z6.1
NetU6_2: U6.2(~{RESET}) Z8.2

Not connected (* = marked no-connect by the designer): FPGA1 A2(IO_L1N_VREF_0) A12(IO_L65N_SCP2_0) B1(IO_L83N_VREF_3) B12(IO_L65P_SCP3_0) C1(IO_L83P_3) C11(IO_L66N_SCP0_0) D1(IO_L52N_3) D2(IO_L52P_3) D3(IO_L51N_3) D4(IO_L51P_3) D11(IO_L66P_SCP1_0) E1(IO_L50N_3) E2(IO_L50P_3) F2(IO_L44P_GCLK21_3) F3(IO_L49N_3) F4(IO_L49P_3) G1(IO_L42N_GCLK24_3) G2(IO_L42P_GCLK25_TRDY2_3) H1(IO_L43N_GCLK22_IRDY2_3) H2(IO_L43P_GCLK23_3) J1(IO_L41N_GCLK26_3) J2(IO_L41P_GCLK27_3) J3(IO_L37N_3) J4(IO_L37P_3) K1(IO_L36N_3) K14(IO_L47N_1) L1(IO_L2N_3) L2(IO_L2P_3) L4(IO_L62P_D5_2) L8(IO_L14P_D11_2) L13(IO_L53P_1) L14(IO_L53N_VREF_1) M1(IO_L1N_VREF_3) M2(IO_L1P_3) M4(IO_L62N_D6_2) M8(IO_L14N_D12_2) M12(CMPCS_B_2) M13(IO_L74P_AWAKE_1) M14(IO_L74N_DOUT_BUSY_1) N3(IO_L64P_D8_2) N4(IO_L63P_2) N5(IO_L49P_D3_2) N6(IO_L48P_D7_2) N7(IO_L31P_GCLK31_D14_2) N8(IO_L30P_GCLK1_D13_2) N10(IO_L12P_D1_MISO2_2) N12(IO_L2P_CMPCLK_2) P3(IO_L64N_D9_2) P4(IO_L63N_2) P5(IO_L49N_D4_2) P6(IO_L48N_RDWR_B_VREF_2) P7(IO_L31N_GCLK30_D15_2) P8(IO_L30N_GCLK0_USERCCLK_2) P9(IO_L13N_D10_2) P10(IO_L12N_D2_MISO3_2) P12(IO_L2N_CMPMOSI_2); T1 3(C); Z10 1

### Buses and harness runs
bus DOUT[0..11] = port DOUT[0..11]

### Notes on the sheet
- VCCINT decoupling Pin 19, 28, 52, 89, 128
- VCCAUX decoupling: Pin 20, 36, 53, 90, 129
- TieHi
- Oscillator Cricuit for global clock
- (near U4) DO NOT populate the CAP load. NOT FOR STABILITY
- <=== FPGA IN
- FPGA OUT===>
- Flash memory for programming
- (near U6) LM809 active low reset
- (near Z15) Flash VDD = VCCO2 VDD
- (near Z15) S_Selectn (active low) pull-up when HSWAPEN is open or pulled high
- (near Z17) 100 parallel termination for S_CLOCK
- (in symbol XC6SLX16-2CPG196C, part A) BANK 0
- (in symbol XC6SLX16-2CPG196C, part B) BANK 1
- (in symbol XC6SLX16-2CPG196C, part C) BANK 2
- (in symbol XC6SLX16-2CPG196C, part D) BANK 3

### Library data of the parts
D1 = LED3: Typical BLUE SiC LED; Published: 8-Jun-2000; LatestRevisionDate: 17-Dec-2003; LatestRevisionNote: PCB Footprint replaced.; DatasheetVersion: 16-Apr-2002; PackageVersion: 16-Apr-2002; PackageReference: 3.5X2.8X1.9; Publisher: Altium Limited; PackageDescription: SM LED; 2 C-Bend Leads; Body 3.5 x 2.8 x 1.9 mm, inc leads (LxWxH typ)
FPGA1 = XC6SLX16-2CPG196C: Spartan-6 LX 1.2V FPGA, 106 User I/Os, 196-Ball Chip-Scale BGA (0.5mm Pitch), Speed Grade 2, Commercial Grade, Pb-Free; DatasheetVersion: ver1.6, Nov-2010; PackageVersion: ver1.0, Dec-2009; PackageReference: CPG196; PackageDescription: 196-Ball Chip Scale Ball Grid Array 0.5 mm Pitch (CPG196) - Pb-Free; Code_JEDEC: MO-275; ComponentLink1Description: Manufacturer URL; ComponentLink1URL: http://www.xilinx.com/; ComponentLink2Description: Spartan-6 Datasheet; ComponentLink2URL: http://www.xilinx.com/support/documentation/data_sheets/ds160.pdf; ComponentLink3Description: Spartan-6 Documents; ComponentLink3URL: http://www.xilinx.com/support/documentation/spartan-6.htm
Q1-Q24 Q40-Q43 = Cap: Capacitor; Published: 8-Jun-2000; LatestRevisionDate: 17-Jul-2002; LatestRevisionNote: Re-released for DXP Platform.; PackageReference: RAD-0.3; Publisher: Altium Limited; PackageDescription: Radial Cap, Thru-Hole; 2 Leads; 0.3 in Pin Spacing
U3 U5 = SN74LVC2G17
Z1-Z17 = Res1: Resistor; Published: 8-Jun-2000; LatestRevisionDate: 17-Jul-2002; LatestRevisionNote: Re-released for DXP Platform.; PackageReference: AXIAL-0.3; Publisher: Altium Limited; PackageDescription: Axial Device, Thru-Hole; 2 Leads; 0.3 in Pin Spacing
  Z9: Value: ?

## Sheet led-driver.SchDoc
size A
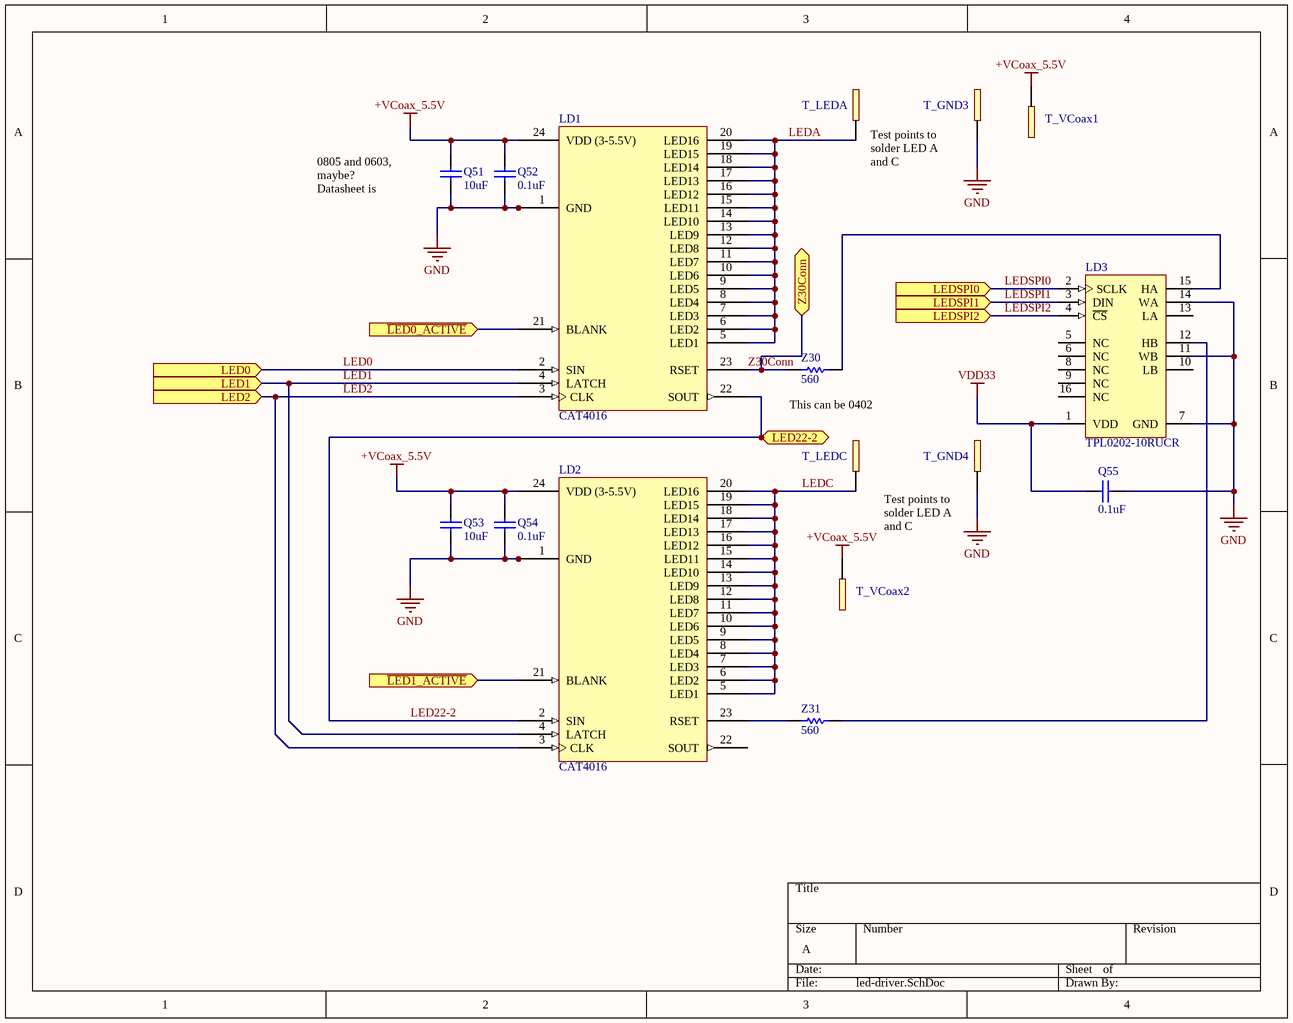
[diagram p6: led-driver.SchDoc]

### Parts
LD1  CAT4016  [TQFN24-4x4mm]
LD2  CAT4016  [TQFN24-4x4mm]
LD3  TPL0202-10RUCR  [WQFN16-3X3mm]
Q51  value 10uF  [Cap-0603]  (hidden comment: Cap)
Q52  value 0.1uF  [Cap_0402]  (hidden comment: Cap)
Q53  value 10uF  [Cap-0603]  (hidden comment: Cap)
Q54  value 0.1uF  [Cap_0402]  (hidden comment: Cap)
Q55  value 0.1uF  [Cap_0402]  (hidden comment: Cap)
T_GND3  Header_1PIN  [JUMPER1PIN]  (value not drawn)
T_GND4  Header_1PIN  [JUMPER1PIN]  (value not drawn)
T_LEDA  Header_1PIN  [JUMPER1PIN]  (value not drawn)
T_LEDC  Header_1PIN  [JUMPER1PIN]  (value not drawn)
T_VCoax1  Header_1PIN  [JUMPER1PIN]  (value not drawn)
T_VCoax2  Header_1PIN  [JUMPER1PIN]  (value not drawn)
Z30  value 560  [Res_0402]  (hidden comment: Res1)
Z31  value 560  [Res_0402]  (hidden comment: Res1)

### Ports
LED0 (in), LED1 (in), LED2 (in), LED22-2, LEDSPI0 (in), LEDSPI1 (in), LEDSPI2 (in), Z30Conn (bidir), ~{LED0_ACTIVE} (in), ~{LED1_ACTIVE} (in)

### Nets
+VCoax_5.5V: LD1.24(VDD_(3-5.5V)) LD2.24(VDD_(3-5.5V)) Q51.2 Q52.2 Q53.2 Q54.2 T_VCoax1.0 T_VCoax2.0
GND: LD1.1(GND) LD1.PAD LD2.1(GND) LD2.PAD LD3.7(GND) LD3.11(WB) LD3.14(WA) Q51.1 Q52.1 Q53.1 Q54.1 Q55.2 T_GND3.0 T_GND4.0
VDD33: LD3.1(VDD) Q55.1
LED0: LD1.2(SIN) ; port LED0
LED1: LD1.4(LATCH) LD2.4(LATCH) ; port LED1
LED2: LD1.3(CLK) LD2.3(CLK) ; port LED2
LED22-2: LD1.22(SOUT) LD2.2(SIN) ; port LED22-2
LEDA: LD1.5(LED1) LD1.6(LED2) LD1.7(LED3) LD1.8(LED4) LD1.9(LED5) LD1.10(LED6) LD1.11(LED7) LD1.12(LED8) LD1.13(LED9) LD1.14(LED10) LD1.15(LED11) LD1.16(LED12) LD1.17(LED13) LD1.18(LED14) LD1.19(LED15) LD1.20(LED16) T_LEDA.0
LEDC: LD2.5(LED1) LD2.6(LED2) LD2.7(LED3) LD2.8(LED4) LD2.9(LED5) LD2.10(LED6) LD2.11(LED7) LD2.12(LED8) LD2.13(LED9) LD2.14(LED10) LD2.15(LED11) LD2.16(LED12) LD2.17(LED13) LD2.18(LED14) LD2.19(LED15) LD2.20(LED16) T_LEDC.0
LEDSPI0: LD3.2(SCLK) ; port LEDSPI0
LEDSPI1: LD3.3(DIN) ; port LEDSPI1
LEDSPI2: LD3.4(~{CS}) ; port LEDSPI2
Z30Conn: LD1.23(RSET) Z30.2 ; port Z30Conn
NetLD1_21: LD1.21(BLANK) ; port ~{LED0_ACTIVE}
NetLD2_21: LD2.21(BLANK) ; port ~{LED1_ACTIVE}
NetLD2_23: LD2.23(RSET) Z31.2
NetLD3_12: LD3.12(HB) Z31.1
NetLD3_15: LD3.15(HA) Z30.1

Not connected (* = marked no-connect by the designer): LD2 22(SOUT); LD3 5(NC) 6(NC) 8(NC) 9(NC) 10(LB) 13(LA) 16(NC)

### Notes on the sheet
- Test points to solder LED A and C
- (near Q51) 0805 and 0603, maybe? Datasheet is lacking...
- (near Z30) This can be 0402

### Library data of the parts
LD1 LD2 = CAT4016: 16-Channel Constant Current LED Driver
LD3 = TPL0202-10RUCR: 256 Tap, Dual Channel Digital Potentiometer with SPI Interface and Non-Volatile Memory, -40 to 85 degC, 14-pin QFN (RUC14); Manufacturer: Texas Instruments; DAC Channels: 2; DNL(Max)(+/-LSB): 0.5; INL(Max)(+/-LSB): 1; DatasheetVersion: SLIS135C; PackageVersion: 4208447/C, 08/2008; PackageReference: RUC14; PackageDescription: 14-Pin Plastic Quad Flatpack No-Lead, Body 2 x 2 mm, Pitch 0.4 mm; Supplier 1: Mouser; Supplier Part Number 1: N/A; Interface: SPI; SubFamily: Digital Potentiometer; Mounting Technology: Surface Mount; Code_JEDEC: MO-288; PartNumber: TPL0202-10RUCR; ComponentLink1Description: Manufacturer URL; ComponentLink1URL: http://www.ti.com/; ComponentLink2Description: Datasheet; ComponentLink2URL: http://www.ti.com/general/docs/lit/getliterature.tsp?genericPartNumber=TPL0202-10&fileType=pdf; ComponentLink3Description: Package Specification; ComponentLink3URL: http://www.ti.com/lit/ml/mpqf212b/mpqf212b.pdf
Q51-Q55 = Cap: Capacitor; Published: 8-Jun-2000; LatestRevisionDate: 17-Jul-2002; LatestRevisionNote: Re-released for DXP Platform.; PackageReference: RAD-0.3; Publisher: Altium Limited; PackageDescription: Radial Cap, Thru-Hole; 2 Leads; 0.3 in Pin Spacing
Z30 Z31 = Res1: Resistor; Published: 8-Jun-2000; LatestRevisionDate: 17-Jul-2002; LatestRevisionNote: Re-released for DXP Platform.; PackageReference: AXIAL-0.3; Publisher: Altium Limited; PackageDescription: Axial Device, Thru-Hole; 2 Leads; 0.3 in Pin Spacing

## Sheet imu.SchDoc
size A
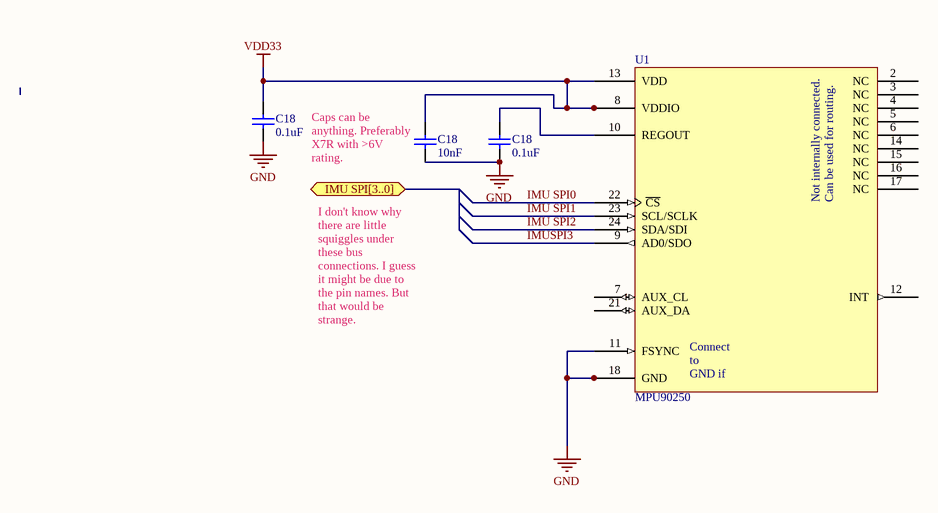
[diagram p7: imu.SchDoc]

### Parts
(Parts that share a designator on the sheet are numbered #1, #2 ... from top to bottom, then left to right.)
C18#2  value 0.1uF  [RAD-0.3]  (hidden comment: Cap)
C18#3  value 10nF  [RAD-0.3]  (hidden comment: Cap)
C18#4  value 0.1uF  [RAD-0.3]  (hidden comment: Cap)
U1#2  MPU90250  [QFN24-3x3mm]

### Ports
IMU SPI[3..0] (bidir)

### Nets
GND: C18#2.2 C18#3.2 C18#4.2 U1#2.11(FSYNC) U1#2.18(GND) U1#2.20(RESV)
VDD33: C18#2.1 C18#3.1 U1#2.1(RESV) U1#2.8(VDDIO) U1#2.13(VDD)
IMU SPI0: U1#2.22(~{CS})
IMU SPI1: U1#2.23(SCL/SCLK)
IMU SPI2: U1#2.24(SDA/SDI)
IMUSPI3: U1#2.9(AD0/SDO)
NetC18#4_1: C18#4.1 U1#2.10(REGOUT)

Not connected (* = marked no-connect by the designer): U1#2 2(NC) 3(NC) 4(NC) 5(NC) 6(NC) 7(AUX_CL) 12(INT) 14(NC) 15(NC) 16(NC) 17(NC) 19(DO_NOT_CONNECT) 21(AUX_DA)

### Notes on the sheet
- (near C18#3) Caps can be anything. Preferably X7R with >6V rating.
- I don't know why there are little squiggles under these bus connections. I guess it might be due to the pin names. But that would be strange.
- (in symbol MPU90250) Not internally connected.; Can be used for routing.; Connect to / GND if / not in use

### Library data of the parts
C18#2-C18#4 = Cap: Capacitor; Published: 8-Jun-2000; LatestRevisionDate: 17-Jul-2002; LatestRevisionNote: Re-released for DXP Platform.; PackageReference: RAD-0.3; Publisher: Altium Limited; PackageDescription: Radial Cap, Thru-Hole; 2 Leads; 0.3 in Pin Spacing
U1#2 = MPU90250: 9-Axis IMU (Accel, Gyro, Magno)

## Nets that join several sheets
+VCoax_12V: coaxial-port (L5.2), power-supplies (12 pins)
GND: coaxial-port (C1.1 C2.1 J1.1), power-supplies (23 pins), serial-io (19 pins), Headstage_withFPGA_BGA (81 pins), led-driver (14 pins), imu (6 pins)
VCC33: power-supplies (6 pins), Headstage_withFPGA_BGA (Q42.1 Q43.1 U1#1.10 U2.10)
VDD12: power-supplies (Q33.2 U8.A1 U8.B1), Headstage_withFPGA_BGA (21 pins)
VDD33: power-supplies (Q32.2 U8.D1 U8.E1), serial-io (6 pins), Headstage_withFPGA_BGA (64 pins), led-driver (LD3.1 Q55.1), imu (5 pins)
DIN0: serial-io (U9.19), Headstage_withFPGA_BGA (FPGA1.F14)
DIN1: serial-io (U9.20), Headstage_withFPGA_BGA (FPGA1.F13)
DIN2: serial-io (U9.21), Headstage_withFPGA_BGA (FPGA1.G14)
DIN3: serial-io (U9.22), Headstage_withFPGA_BGA (FPGA1.G13)
DIN4: serial-io (U9.23), Headstage_withFPGA_BGA (FPGA1.F12)
DIN5: serial-io (U9.24), Headstage_withFPGA_BGA (FPGA1.F11)
DIN6: serial-io (U9.26), Headstage_withFPGA_BGA (FPGA1.E14)
DIN7: serial-io (U9.27), Headstage_withFPGA_BGA (FPGA1.E13)
DIN8: serial-io (U9.29), Headstage_withFPGA_BGA (FPGA1.D14)
DIN9: serial-io (U9.30), Headstage_withFPGA_BGA (FPGA1.D13)
DIN10: serial-io (U9.31), Headstage_withFPGA_BGA (FPGA1.C13)
DIN11: serial-io (U9.32), Headstage_withFPGA_BGA (FPGA1.C12)
GPO0: serial-io (U9.15), Headstage_withFPGA_BGA (FPGA1.K13)
GPO1: serial-io (U9.16), Headstage_withFPGA_BGA (FPGA1.H12)
GPO2: serial-io (U9.17), Headstage_withFPGA_BGA (FPGA1.H11)
GPO3: serial-io (U9.18), Headstage_withFPGA_BGA (FPGA1.H14)
HS: serial-io (U9.1), Headstage_withFPGA_BGA (FPGA1.J11)
NetC18#1_1: coaxial-port (J1.0 L6.1 R9.2), serial-io (C18#1.1)
PCLK: serial-io (U9.3), Headstage_withFPGA_BGA (FPGA1.H13)
SCL: serial-io (R8.1 U9.4), Headstage_withFPGA_BGA (FPGA1.J14)
SDA: serial-io (R7.1 U9.5), Headstage_withFPGA_BGA (FPGA1.J13)
VS: serial-io (U9.2), Headstage_withFPGA_BGA (FPGA1.J12)